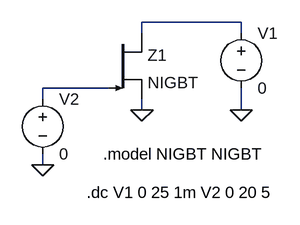
[diagram p0: schematic IGBT.asc]
IGBT.asc, the LTspice schematic file:
Version 4
SHEET 1 880 680
WIRE 416 144 272 144
WIRE 272 160 272 144
WIRE 416 160 416 144
WIRE 224 240 128 240
WIRE 128 256 128 240
WIRE 272 272 272 256
WIRE 416 272 416 240
WIRE 128 352 128 336
FLAG 416 272 0
FLAG 272 272 0
FLAG 128 352 0
SYMBOL misc\\nigbt 224 160 R0
SYMATTR InstName Z1
SYMATTR Prefix Z
SYMBOL voltage 416 144 R0
SYMATTR InstName V1
SYMATTR Value 0
SYMBOL voltage 128 240 R0
SYMATTR InstName V2
SYMATTR Value 0
TEXT 216 336 Left 2 !.model NIGBT NIGBT
TEXT 192 392 Left 2 !.dc V1 0 25 1m V2 0 20 5

The netlist it stands for:
* IGBT.asc
Z1 N001 N002 0 NIGBT
V1 N001 0 0
V2 N002 0 0
.model NIGBT NIGBT
.dc V1 0 25 1m V2 0 20 5
.backanno
.end